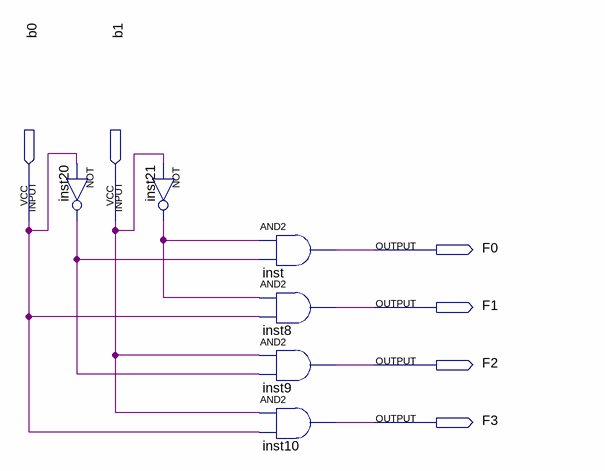
[diagram p0: schematic sheet]
// Quartus schematic No4.bdf as structural Verilog: 6 symbols, 6 pins
module No4 (
  input  b0,
  input  b1,
  output F0,
  output F1,
  output F2,
  output F3
);

  wire inst20_out, inst21_out;

  not inst20 (inst20_out, b0);
  not inst21 (inst21_out, b1);
  and inst (F0, inst21_out, inst20_out);
  and inst8 (F1, inst21_out, b0);
  and inst9 (F2, b1, inst20_out);
  and inst10 (F3, b1, b0);
endmodule
